# EAGLE schematic 9led-breakout (EAGLE 6.5.0)
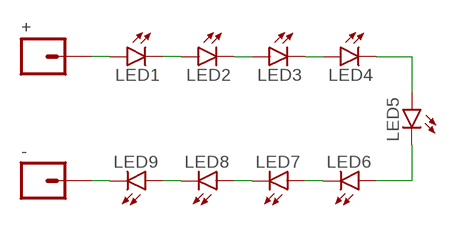
[diagram p0: schematic, sheet 1]

## Parts
+  M01PTH-KIT  [1X01-KIT]
-  M01NOSILK-KIT  [1X01NS-KIT]
LED1  LED5MM  [LED5MM]
LED2  LED5MM  [LED5MM]
LED3  LED5MM  [LED5MM]
LED4  LED5MM  [LED5MM]
LED5  LED5MM  [LED5MM]
LED6  LED5MM  [LED5MM]
LED7  LED5MM  [LED5MM]
LED8  LED5MM  [LED5MM]
LED9  LED5MM  [LED5MM]

## Nets
N$1: +.1 LED1.A
N$2: LED1.K(C) LED2.A
N$3: LED2.K(C) LED3.A
N$4: LED3.K(C) LED4.A
N$5: LED4.K(C) LED5.A
N$6: LED5.K(C) LED6.A
N$7: LED6.K(C) LED7.A
N$8: LED7.K(C) LED8.A
N$9: LED8.K(C) LED9.A
N$10: -.1 LED9.K(C)

## Library data of the parts
+ - = A_butts:M01: Header 1 Standard 1-pin 0.1" header. Use with straight break away headers (SKU : PRT-00116), right angle break away headers (PRT-00553), swiss pins (PRT-00743), machine pins (PRT-00117), and female headers (PRT-00115).
LED1-LED9 = A_butts:LED: LEDs Standard schematic elements and footprints for 5mm, 3mm, 1206, and 0603 sized LEDs. 5mm - Spark Fun Electronics SKU : COM-00529 (and others)